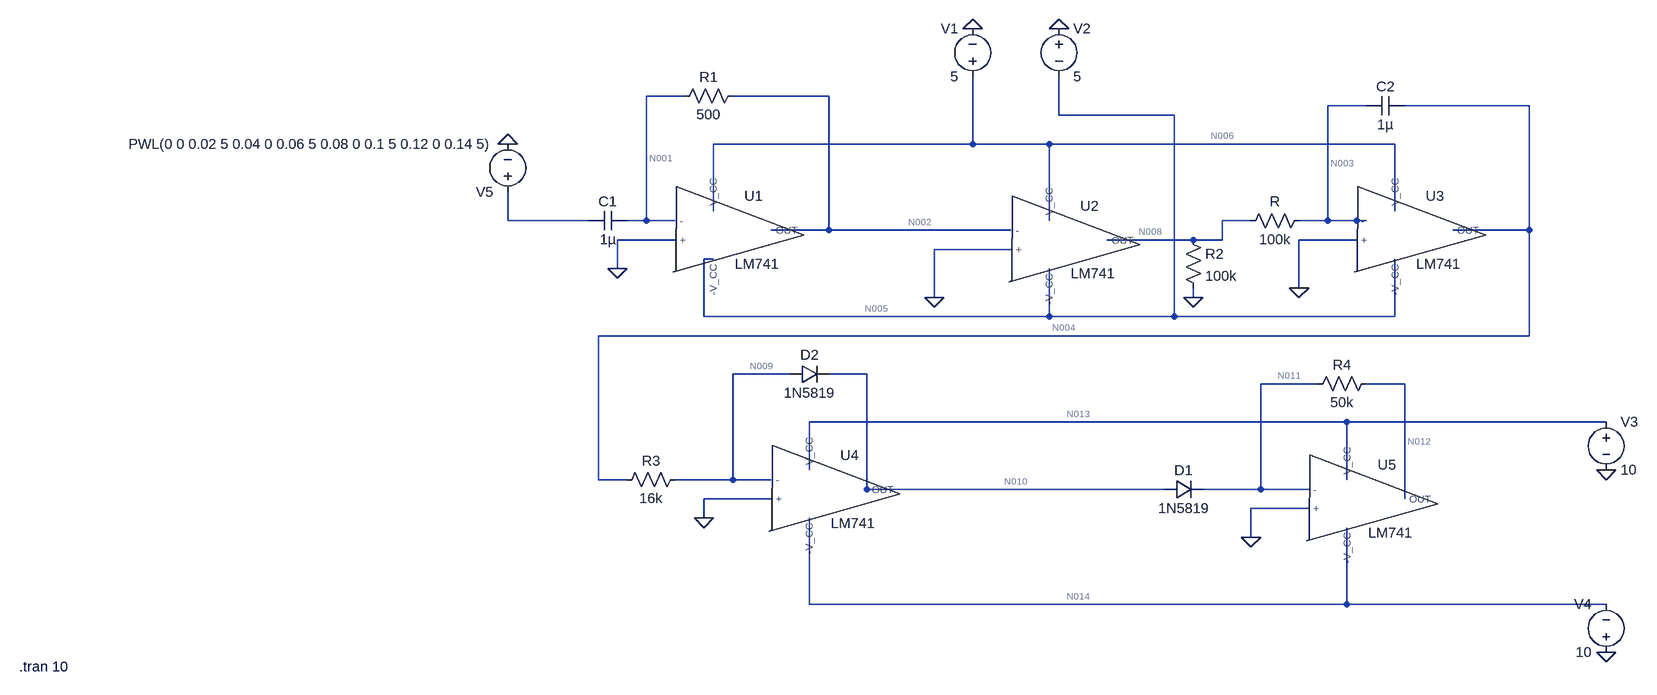
[diagram p0: schematic F_to_V_FINAL.asc]
F_to_V_FINAL.asc, the LTspice schematic file:
Version 4.1
SHEET 1 1616 824
WIRE -80 -144 -144 -144
WIRE 160 -144 0 -144
WIRE 1056 -128 992 -128
WIRE 1328 -128 1120 -128
WIRE 544 -112 544 -176
WIRE 736 -112 544 -112
WIRE 400 -64 400 -176
WIRE 400 -64 -32 -64
WIRE 528 -64 400 -64
WIRE 1104 -64 528 -64
WIRE -32 48 -32 -64
WIRE 1104 48 1104 -64
WIRE -480 64 -480 16
WIRE -240 64 -480 64
WIRE -144 64 -144 -144
WIRE -144 64 -176 64
WIRE -96 64 -144 64
WIRE 528 64 528 -64
WIRE 864 64 816 64
WIRE 992 64 992 -128
WIRE 992 64 944 64
WIRE 1040 64 992 64
WIRE 1056 64 1040 64
WIRE 160 80 160 -144
WIRE 160 80 64 80
WIRE 464 80 160 80
WIRE 1328 80 1328 -128
WIRE 1328 80 1200 80
WIRE -96 96 -192 96
WIRE 768 96 624 96
WIRE 816 96 816 64
WIRE 816 96 768 96
WIRE 1040 96 944 96
WIRE 464 112 336 112
WIRE -32 128 -48 128
WIRE -192 144 -192 96
WIRE 944 176 944 96
WIRE 336 192 336 112
WIRE 768 192 768 176
WIRE -48 224 -48 128
WIRE 528 224 528 144
WIRE 528 224 -48 224
WIRE 736 224 736 -112
WIRE 736 224 528 224
WIRE 1104 224 1104 128
WIRE 1104 224 736 224
WIRE 1328 256 1328 80
WIRE 1328 256 -224 256
WIRE 96 320 0 320
WIRE 224 320 160 320
WIRE 976 336 880 336
WIRE 1120 336 1056 336
WIRE 1024 400 128 400
WIRE 1456 400 1024 400
WIRE 128 480 128 400
WIRE -224 496 -224 256
WIRE -176 496 -224 496
WIRE 0 496 0 320
WIRE 0 496 -96 496
WIRE 64 496 0 496
WIRE 1024 496 1024 400
WIRE 224 512 224 320
WIRE 720 512 224 512
WIRE 880 512 880 336
WIRE 880 512 784 512
WIRE 960 512 880 512
WIRE 64 528 -48 528
WIRE 1120 528 1120 336
WIRE 960 544 864 544
WIRE -48 560 -48 528
WIRE 864 592 864 544
WIRE 128 704 128 560
WIRE 1024 704 1024 576
WIRE 1024 704 128 704
WIRE 1456 704 1024 704
FLAG 336 192 0
FLAG 944 176 0
FLAG -192 144 0
FLAG -48 560 0
FLAG 864 592 0
FLAG 544 -256 0
FLAG 400 -256 0
FLAG 1456 480 0
FLAG 1456 784 0
FLAG -480 -64 0
FLAG 768 192 0
SYMBOL LM741 -32 80 R0
SYMATTR InstName U1
SYMBOL LM741 528 96 R0
SYMATTR InstName U2
SYMBOL LM741 1104 80 R0
SYMATTR InstName U3
SYMBOL cap -176 48 R90
WINDOW 0 0 32 VBottom 2
WINDOW 3 32 32 VTop 2
SYMATTR InstName C1
SYMATTR Value 1µ
SYMBOL res 16 -160 R90
WINDOW 0 0 56 VBottom 2
WINDOW 3 32 56 VTop 2
SYMATTR InstName R1
SYMATTR Value 500
SYMBOL res 960 48 R90
WINDOW 0 0 56 VBottom 2
WINDOW 3 32 56 VTop 2
SYMATTR InstName R
SYMATTR Value 100k
SYMBOL cap 1120 -144 R90
WINDOW 0 0 32 VBottom 2
WINDOW 3 32 32 VTop 2
SYMATTR InstName C2
SYMATTR Value 1µ
SYMBOL LM741 128 512 R0
SYMATTR InstName U4
SYMBOL LM741 1024 528 R0
SYMATTR InstName U5
SYMBOL diode 720 528 R270
WINDOW 0 32 32 VTop 2
WINDOW 3 0 32 VBottom 2
SYMATTR InstName D1
SYMATTR Value 1N5819
SYMBOL diode 96 336 R270
WINDOW 0 32 32 VTop 2
WINDOW 3 0 32 VBottom 2
SYMATTR InstName D2
SYMATTR Value 1N5819
SYMBOL res -80 480 R90
WINDOW 0 0 56 VBottom 2
WINDOW 3 32 56 VTop 2
SYMATTR InstName R3
SYMATTR Value 16k
SYMBOL res 1072 320 R90
WINDOW 0 0 56 VBottom 2
WINDOW 3 32 56 VTop 2
SYMATTR InstName R4
SYMATTR Value 50k
SYMBOL voltage 400 -160 R180
WINDOW 0 24 96 Left 2
WINDOW 3 24 16 Left 2
WINDOW 123 0 0 Left 0
WINDOW 39 0 0 Left 0
SYMATTR InstName V1
SYMATTR Value 5
SYMBOL voltage 544 -272 R0
WINDOW 123 0 0 Left 0
WINDOW 39 0 0 Left 0
SYMATTR InstName V2
SYMATTR Value 5
SYMBOL voltage 1456 384 R0
WINDOW 123 0 0 Left 0
WINDOW 39 0 0 Left 0
SYMATTR InstName V3
SYMATTR Value 10
SYMBOL voltage 1456 800 R180
WINDOW 0 24 96 Left 2
WINDOW 3 24 16 Left 2
WINDOW 123 0 0 Left 0
WINDOW 39 0 0 Left 0
SYMATTR InstName V4
SYMATTR Value 10
SYMBOL voltage -480 32 R180
WINDOW 123 0 0 Left 0
WINDOW 39 0 0 Left 0
SYMATTR InstName V5
SYMATTR Value PWL(0 0 0.02 5 0.04 0 0.06 5 0.08 0 0.1 5 0.12 0 0.14 5)
SYMBOL res 752 80 R0
SYMATTR InstName R2
SYMATTR Value 100k
TEXT -2568 808 Left 2 !.tran 10

The netlist it stands for:
* F_to_V_FINAL.asc
X§U1 0 N001 N006 N005 N002 LM741  ; pins + - V_CC -V_CC OUT
X§U2 0 N002 N006 N005 N008 LM741  ; pins + - V_CC -V_CC OUT
X§U3 0 N003 N006 N005 N004 LM741  ; pins + - V_CC -V_CC OUT
C1 N001 N007 1µ
R1 N002 N001 500
R N003 N008 100k
C2 N004 N003 1µ
X§U4 0 N009 N013 N014 N010 LM741  ; pins + - V_CC -V_CC OUT
X§U5 0 N011 N013 N014 N012 LM741  ; pins + - V_CC -V_CC OUT
D1 N010 N011 1N5819
D2 N009 N010 1N5819
R3 N009 N004 16k
R4 N012 N011 50k
V1 N006 0 5
V2 0 N005 5
V3 N013 0 10
V4 0 N014 10
V5 N007 0 PWL(0 0 0.02 5 0.04 0 0.06 5 0.08 0 0.1 5 0.12 0 0.14 5)
R2 N008 0 100k
.model D D
.lib standard.dio
.tran 10
.lib F:\DOWNLOADS\snom211b\lm741.lib
.backanno
.end

* Results of the author's LTspice run, read from the files saved beside the schematic
* Operating Point, zero values left out:
*   V(n006) = 5 V
*   V(n002) = 1.051 mV
*   V(n008) = -3.828 V
*   V(n004) = 3.99 V
*   V(n013) = 10 V
*   V(n010) = -76.49 mV
*   V(n011) = 992.9 µV
*   V(n001) = 1 mV
*   V(n005) = -5 V
*   V(n003) = -3.192 V
*   V(n009) = 1.001 mV
*   V(n014) = -10 V
*   V(n012) = 1.412 V
*   I(R3) = -249.3 µA
*   I(R4) = 28.22 µA
*   I(R) = 6.363 µA
*   I(D1) = -28.12 µA
*   I(V2) = -4.322 mA
*   I(V4) = -3.358 mA
*   I(V1) = -4.526 mA
*   I(R2) = -38.28 µA
*   I(R1) = 101.9 nA
*   I(D2) = 249.2 µA
*   I(V3) = -3.108 mA